# Altium schematic sheet OZ440-SE100-CAR003_sheet16.SchDoc
size A3
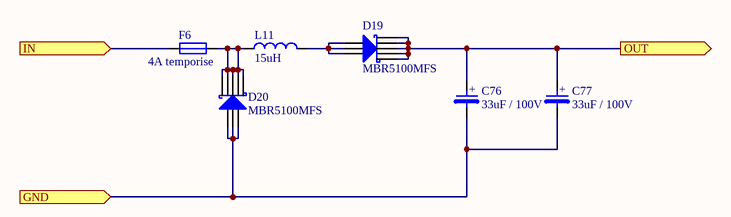
[diagram p0: OZ440-SE100-CAR003_sheet16.SchDoc]

## Parts
C76  Displayed reference: 33uF / 100V  [CAP-ELECTRO-SMD_SIZE_G]  (hidden comment: CAP-POL-SMD)
C77  Displayed reference: 33uF / 100V  [CAP-ELECTRO-SMD_SIZE_G]  (hidden comment: CAP-POL-SMD)
D19  Displayed reference: MBR5100MFS  [SO8-SPE-MBR5100MFS]  (hidden comment: MBR5100MFS-SO8)
D20  Displayed reference: MBR5100MFS  [SO8-SPE-MBR5100MFS]  (hidden comment: MBR5100MFS-SO8)
F6  Displayed reference: 4A temporise  [F1206-STD]  (hidden comment: FUSE-SMD)
L11  Displayed reference: 15uH  [L-SPE-XAL60xx]  (hidden comment: IND-SMD)

## Ports
GND (in), IN (in), OUT (out)

## Nets
GND: C76.2 C77.2 D20.1(A) D20.2(A) D20.3(A) ; port GND
IN: F6.1 ; port IN
OUT: C76.1 C77.1 D19.5(K) D19.6(K) D19.7(K) D19.8(K) ; port OUT
NetD19_1: D19.1(A) D19.2(A) D19.3(A) L11.2
NetD20_5: D20.5(K) D20.6(K) D20.7(K) D20.8(K) F6.2 L11.1

## Notes on the sheet
- Titre document:
- NAIO TECHNOLOGIES
- 3 Av didier Daurat
- 31400 TOULOUSE
- Auteur:
- Numéro document:
- Verificateur:
- Format:
- A3
- Date:
- Revision:
- Page:
- /
- (in symbol EEE2AA330P) +

## Library data of the parts
C76 C77 = EEE2AA330P: 33uF / 100V Aluminium capacitor SMD; Manufacturer: Panasonic; Max Current: 0.05; Reference: EEE2AA330P; Value: 33uF; Max Voltage: 100V; Material: Aluminium; Footprint description: 10mmx10mm; Pin Count: 2; helpURL: http://industrial.panasonic.com/www-data/pdf/ABA0000/ABA0000CE2.pdf; Supplier 1: Farnell; Supplier Part Number 1: 1899628; Supplier 2: Mouser; Supplier Part Number 2: 667-EEE-2AA330P
D19 D20 = MBR5100MFS: Power shottky Diode; Manufacturer: ON semi; Max Voltage: 100; Max Current: 5A; Validated: False; Reference: MBR5100MFS; component type: Schottky diode; Footprint description: SO8 Flat lead; Pin Count: 10; Rev: D; helpURL: http://www.onsemi.com/pub_link/Collateral/MBR5100MFS-D.PDF; Supplier 1: Mouser; Supplier Part Number 1: 863-MBR5100MFST1G; Supplier 2: Digi-Key; Supplier Part Number 2: MBR5100MFST3G-ND
F6 = MC12CT 004: 1206 4A 63V temporisé; Manufacturer: MULTICOMP; Validated: False; Reference: MC12CT 004; Max Current: 4A; Pin Count: 2; helpURL: http://www.farnell.com/datasheets/1716418.pdf; Supplier 1: Farnell; Supplier Part Number 1: 1841066
L11 = XAL6060-153ME: 15uH SMD inductor; Manufacturer: COILCRAFT; Max Current: 6A; Frequency band: 11Mhz; Validated: False; Reference: XAL6060-153ME; Value: 15uH; Footprint description: SMD 2 pin; Pin Count: 2; Rev: 11/20/12; helpURL: http://www.coilcraft.com/pdfs/xal60xx.pdf; Supplier 1: Mouser; Supplier Part Number 1: 994-XAL6060-153MEB; Supplier 2: Farnell; Supplier Part Number 2: 2289092